# EAGLE design Ardy-Pro-Outlin-ev.3 (EAGLE 6.4)
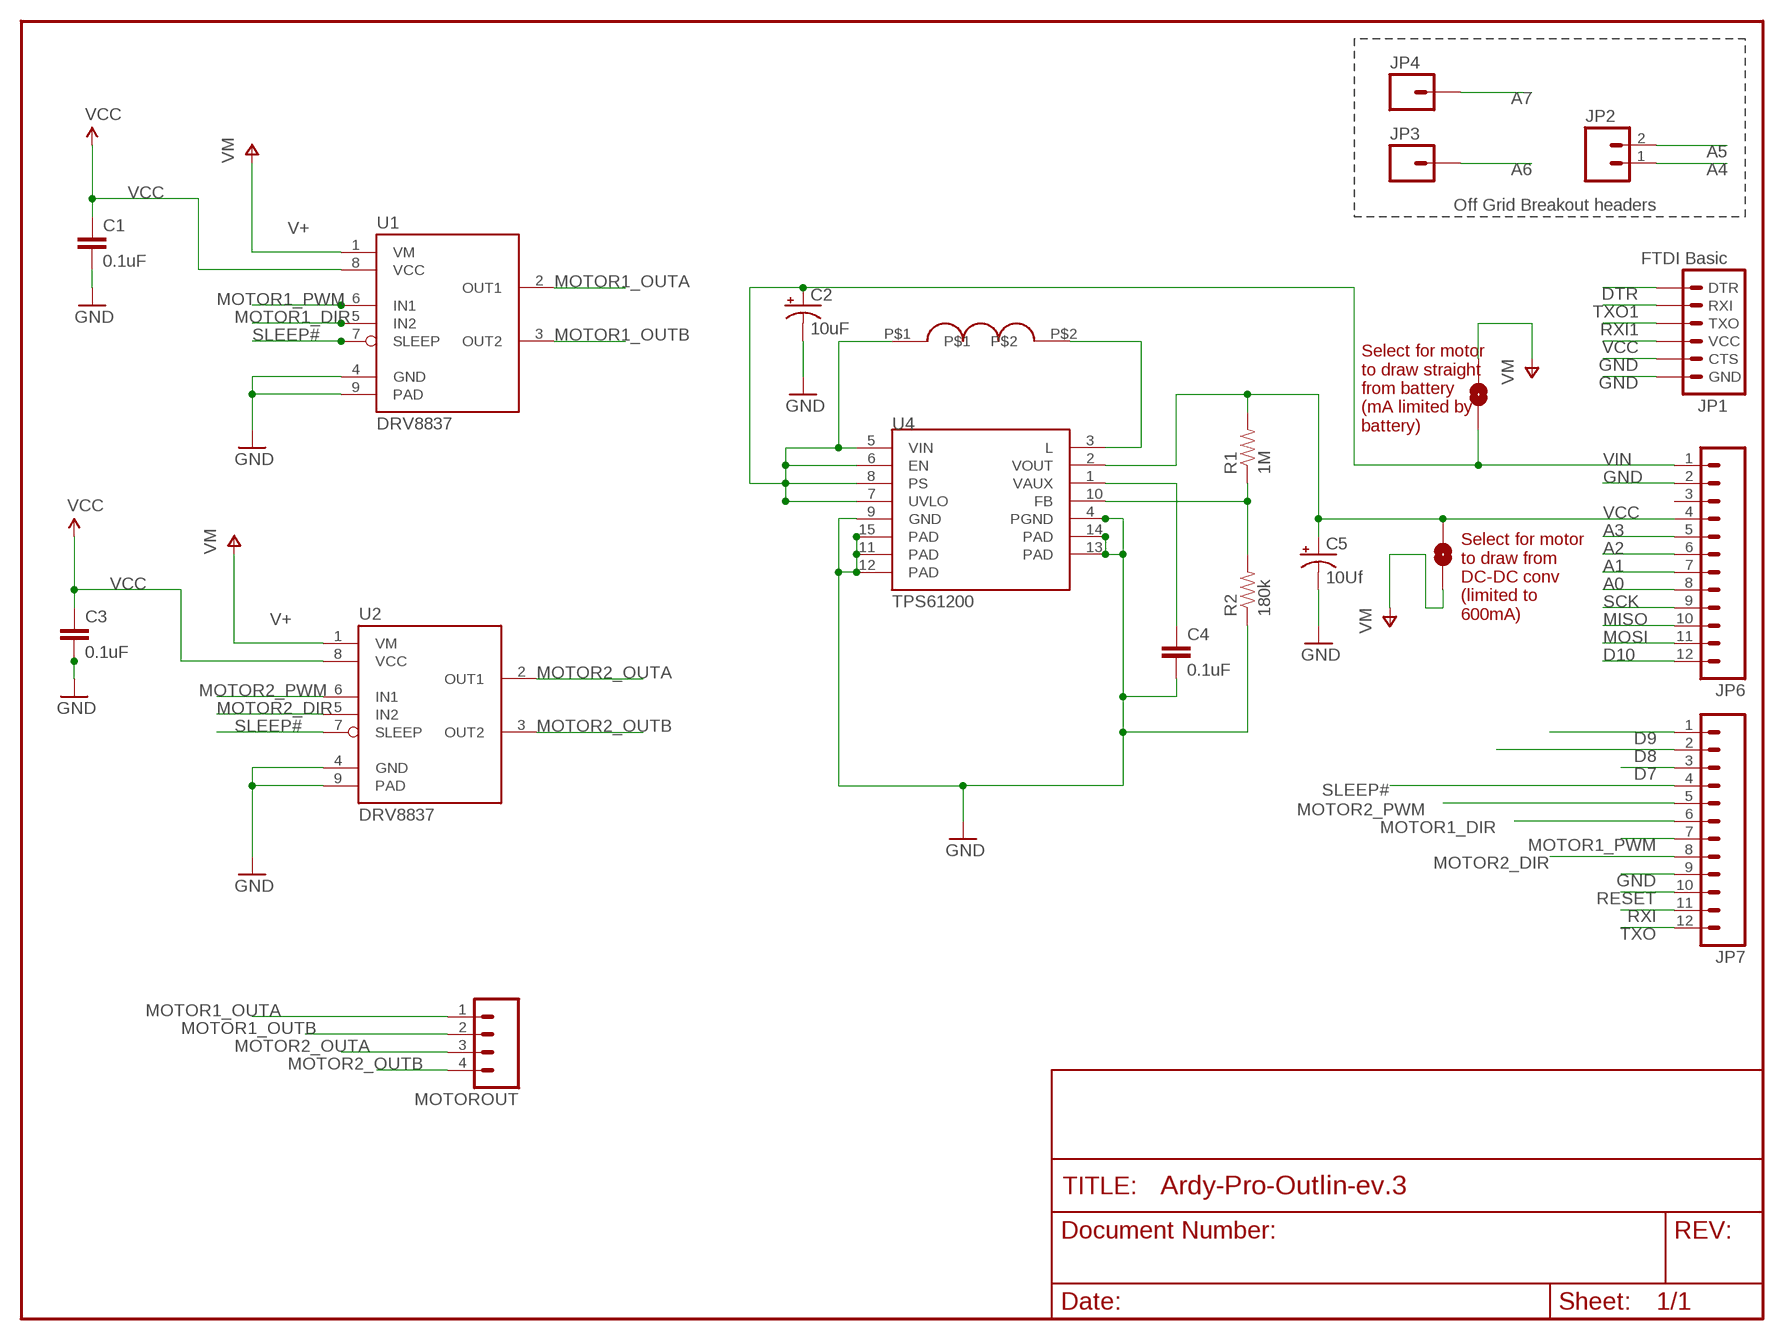
[diagram p0: schematic, sheet 1]

## Parts
2.2UH  2.2uh  2.2UHSMD  [PEBBLE_VLF4012A]
C1  0.1uF  CAP0805  [0805]
C2  10uF  CAP_POL1206  [EIA3216]
C3  0.1uF  CAP0805  [0805]
C4  0.1uF  CAP0805  [0805]
C5  10Uf  CAP_POL1206  [EIA3216]
JP1  FTDI Basic  ARDUINO_SERIAL_PROGRAMPTH  [1X06]
JP2  M02PTH  [1X02]
JP3  M01PTH  [1X01]
JP4  M01PTH  [1X01]
JP6  M12PTH  [1X12]
JP7  M12PTH  [1X12]
MOTOROUT  M04PTH  [1X04]
R1  1M  RESISTOR0805-RES  [0805]
R2  180k  RESISTOR0805-RES  [0805]
SJ1  SOLDERJUMPERNO  [SJ_2S-NO]
SJ2  SOLDERJUMPERNO  [SJ_2S-NO]
U1  DRV8837  AS-ITM-00042  [WSON-8]
U2  DRV8837  AS-ITM-00042  [WSON-8]
U4  TPS61200  [QFN-10_PAD]

## Nets
A0: JP6.8
A1: JP6.7
A2: JP6.6
A3: JP6.5
A4: JP2.1
A5: JP2.2
A6: JP3.1
A7: JP4.1
D7: JP7.3
D8: JP7.2
D9: JP7.1
D10: JP6.12
DTR: JP1.1(DTR)
GND [vcc]: C1.2 C2.C(-) C3.2 C4.2 C5.C(-) JP1.5(CTS) JP1.6(GND) JP6.2 JP7.9 R2.1 U1.4(GND) U1.9(PAD) U2.4(GND) U2.9(PAD) U4.4(PGND) U4.9(GND) U4.11(PAD) U4.12(PAD) U4.13(PAD) U4.14(PAD) U4.15(PAD)
MISO: JP6.10
MOSI: JP6.11
MOTOR1_DIR: JP7.6 U1.5(IN2)
MOTOR1_OUTA: MOTOROUT.1 U1.2(OUT1)
MOTOR1_OUTB: MOTOROUT.2 U1.3(OUT2)
MOTOR1_PWM: JP7.7 U1.6(IN1)
MOTOR2_DIR: JP7.8 U2.5(IN2)
MOTOR2_OUTA: MOTOROUT.3 U2.2(OUT1)
MOTOR2_OUTB: MOTOROUT.4 U2.3(OUT2)
MOTOR2_PWM: JP7.5 U2.6(IN1)
N$1: 2.2UH.P$2 U4.3(L)
N$2: C4.1 U4.1(VAUX)
N$3: R1.1 R2.2 U4.10(FB)
RESET: JP7.10
RXI: JP7.11
RXI1: JP1.3(TXO)
SCK: JP6.9
SLEEP#: JP7.4 U1.7(SLEEP) U2.7(SLEEP)
TXO: JP7.12
TXO1: JP1.2(RXI)
V+ [vcc]: SJ1.1 SJ2.2 U1.1(VM) U2.1(VM) ; supply symbol labelled VM
VCC: C1.1 C3.1 C5.A(+) JP1.4(VCC) JP6.4 R1.2 SJ1.2 U1.8(VCC) U2.8(VCC) U4.2(VOUT)
VIN: 2.2UH.P$1 C2.A(+) JP6.1 SJ2.1 U4.5(VIN) U4.6(EN) U4.7(UVLO) U4.8(PS)
Unconnected: JP6.3

## Notes on the sheet
- Off Grid Breakout headers
- Select for motor
  to draw straight
  from battery
  (mA limited by
  battery)
- Select for motor
  to draw from
  DC-DC conv
  (limited to
  600mA)

## Library data of the parts
2.2UH = Swarm Mini_Fet_Shield-v.01:2.2UHSMD
C1 C3 C4 = SparkFun:CAP: Capacitor Standard 0603 ceramic capacitor, and 0.1" leaded capacitor.
C2 C5 = SparkFun:CAP_POL: Capacitor Polarized These are standard SMD and PTH capacitors. Normally 10uF, 47uF, and 100uF in electrolytic and tantalum varieties. Always verify the external diameter of the through hole cap, it varies with capacity, voltage, and manufacturer. The EIA devices should be standard.
JP1 = SparkFun:ARDUINO_SERIAL_PROGRAM
JP2 = SparkFun:M02: Header 2 Standard 2-pin 0.1" header. Use with straight break away headers (SKU : PRT-00116), right angle break away headers (PRT-00553), swiss pins (PRT-00743), machine pins (PRT-00117), and female headers (PRT-00115). Molex polarized connector foot print use with SKU : PRT-08233 with associated crimp pins and housings.
JP3 JP4 = SparkFun:M01: Header 1 Standard 1-pin 0.1" header. Use with straight break away headers (SKU : PRT-00116), right angle break away headers (PRT-00553), swiss pins (PRT-00743), machine pins (PRT-00117), and female headers (PRT-00115).
JP6 JP7 = SparkFun:M12: Header 12 Standard 12-pin 0.1" header. Use with straight break away headers (SKU : PRT-00116), right angle break away headers (PRT-00553), swiss pins (PRT-00743), machine pins (PRT-00117), and female headers (PRT-00115).
MOTOROUT = SparkFun:M04: Header 4 Standard 4-pin 0.1" header. Use with straight break away headers (SKU : PRT-00116), right angle break away headers (PRT-00553), swiss pins (PRT-00743), machine pins (PRT-00117), and female headers (PRT-00115). Molex polarized connector foot print use with SKU : PRT-08231 with associated crimp pins and housings. 1MM SMD Version SKU: PRT-10208
R1 R2 = SparkFun:RESISTOR: Resistor Basic schematic elements and footprints for 0603, 1206, and PTH resistors.
SJ1 SJ2 = SparkFun:SOLDERJUMPER: Solder Jumper Standard SMD solder jumper. Used to automate production. Two varients : Normally Open and Normally Closed are the same, but have different paste layers. NC will have a large amount of paste and should jumper during reflow.
U1 U2 = tinycircuits:AS-ITM-00042: IC PWM MOTR DVR H-BRDG 8WSON; PARTNO: AS-ITM-00042
U4 = SparkFun:TPS61200: DC to DC Booster

## Net classes
0 default: width 0.203 mm
1 vcc: width 0.254 mm

## Board
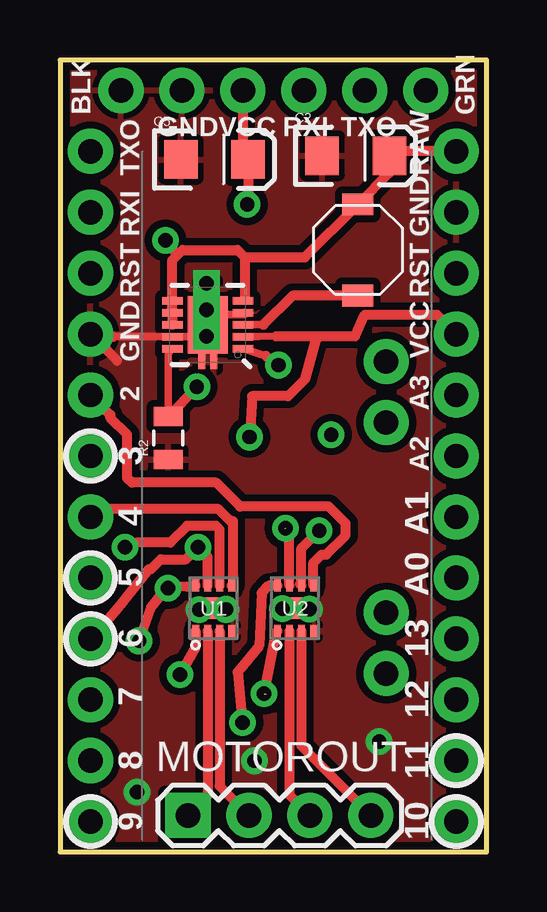
[diagram p1: board, top side]
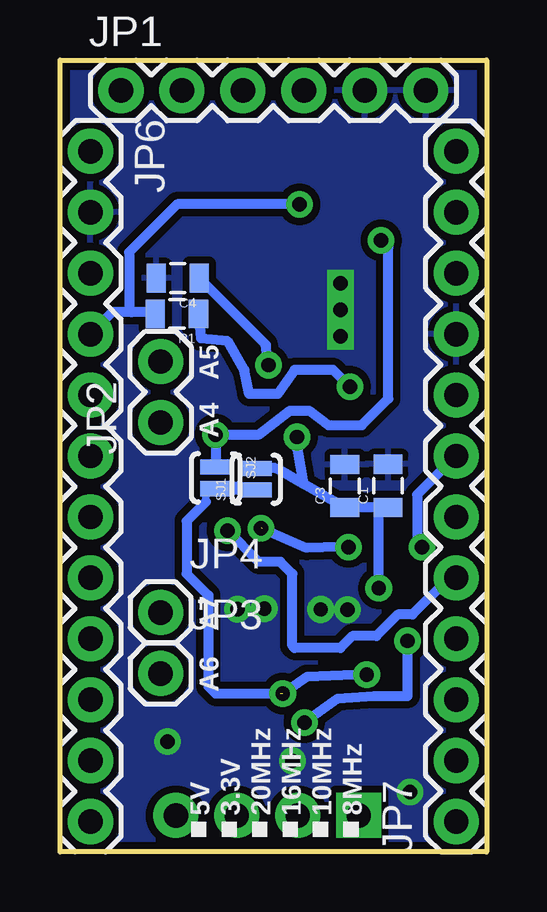
[diagram p2: board, bottom side, seen from below]

Size 17.78 x 33.02 mm. Coordinates in mm from the lower left corner, seen from the top.
Outline: 0,33.02 0,0 17.78,0 17.78,33.02 0,33.02
Copper layers (1*16): Top 0.035mm / dielectric 1.5mm / Bottom 0.035mm
Design rules "default": minimum track width 8mil, minimum drill 20mil, track to track 8mil, track to pad 8mil, pad to pad 8mil, via to via 8mil, smd to smd 8mil, copper to edge 8mil, drill to drill 8mil, minimum pad ring 12mil, minimum via ring 10mil, stop-mask expansion 4mil, vias tented up to drill 20mil, thermal gap 10mil

### Footprints (pad centres in the part's own frame; a part is rotated, then mirrored left to right if it is on the bottom)
PEBBLE_VLF4012A = smd 0.9 x 1.3: P$1 -1.9,0; P$2 1.9,0
0805 = smd 0.8 x 1.2: 1 -0.9,0; 2 0.9,0
EIA3216 = smd 1.4 x 1.6: A 1.4,0; C -1.4,0
1X06 = drill 1.016 pad 1.88: 1 0,0; 2 2.54,0; 3 5.08,0; 4 7.62,0; 5 10.16,0; 6 12.7,0
1X02 = drill 1.016 pad 1.88: 1 0,0; 2 2.54,0
1X01 = drill 1.016 pad 1.88: 1 0,0
1X12 = drill 1.016 pad 1.88: 1 0,0; 2 2.54,0; 3 5.08,0; 4 7.62,0; 5 10.16,0; 6 12.7,0; 7 15.24,0; 8 17.78,0; 9 20.32,0; 10 22.86,0; 11 25.4,0; 12 27.94,0
1X04 = drill 1.016 pad 1.88 square: 1 0,0 | drill 1.016 pad 1.88: 2 2.54,0; 3 5.08,0; 4 7.62,0
SJ_2S-NO = smd 0.635 x 1.27: 1 -0.45,0; 2 0.45,0
WSON-8 = smd 0.28 x 0.5: 1 -0.75,-0.95; 2 -0.25,-0.95; 3 0.25,-0.95; 4 0.75,-0.95; 5 0.75,0.95; 6 0.25,0.95; 7 -0.25,0.95; 8 -0.75,0.95 | smd 1.6 x 0.9: 9 0,0
QFN-10_PAD = smd 0.297 x 0.85: 1 -1,-1.475; 2 -0.5,-1.475; 3 0,-1.475; 4 0.5,-1.475; 5 1,-1.475; 6 1,1.475; 7 0.5,1.475; 8 0,1.475; 9 -0.5,1.475; 10 -1,1.475 | smd 0.7 x 0.28: 11 -1.5,0.25; 12 -1.5,-0.25; 13 1.5,0.25; 14 1.5,-0.25 | smd 2.4 x 1.65: 15 0,0

### Placement (x,y rotation side)
2.2UH  12.4,25.1 270 top
C1  4.11,15.27 90 bottom
C2  12.32,29.02 0 top
C3  5.91,15.26 90 bottom
C4  12.87,23.92 180 bottom
C5  6.44,28.87 0 top
JP1  15.24,31.75 0 bottom
JP2  13.59,17.91 90 bottom
JP3  13.59,7.44 0 bottom
JP4  13.59,9.98 0 bottom
JP6  16.51,29.21 270 bottom
JP7  1.27,1.27 90 bottom
MOTOROUT  5.33,1.52 0 top
R1  12.91,22.44 180 bottom
R2  4.5,17.26 90 top
SJ1  9.6,15.54 90 bottom
SJ2  11.3,15.6 270 bottom
U1  6.41,10.16 0 top
U2  9.81,10.16 0 top
U4  6.16,21.98 90 top

### Tracks (layer width: path | path; a pad name or v marks a point on that pad's centre or on a via)
GND  (via drill 0.6)
  Top 0.305: 2.2,21.48 U4.9 5.89,21.48 5.91,21.5 | U4.4 7.68,22.48 7.7,22.5 7.7,22.4 6.58,22.4 | U4.11 5.91,21.5 | 5.91,21.5 5.91,21.73 U4.15
  Top 0.406: 2.2,21.48 1.38,21.48 JP7.9 2.38,20.48 | U4.13 6.16,23.23 U4.15 6.58,22.4
  other vias: 5.8,10.1 6.92,10.11 8.1,3.8 3.2,2.5 9.27,10.14 10.39,10.12 13.3,4.6 6.1,22.6 6.1,21.5 6.1,23.7
  pour Top (isolate 0.305): 0,33.02 17.78,33.02 17.78,0 0,0
  pour Bottom (isolate 0.305): 0,33.02 17.78,33.02 17.78,0 0,0
MOTOR1_DIR
  Top 0.406: U1.5 7.2,11.15 7.2,13.8 7.1,13.8 6.6,14.3 1.6,14.3 JP7.6
MOTOR1_OUTA
  Top 0.406: U1.2 6.16,2.35 MOTOROUT.1
MOTOR1_OUTB
  Top 0.406: U1.3 6.66,2.74 MOTOROUT.2
MOTOR1_PWM  (via drill 0.6)
  Top 0.406: U1.6 6.65,13.45 6.5,13.6 5.3,13.6 4.6,12.9 3.2,12.9 v2.7,12.7
  Bottom 0.406: JP7.7 1.29,16.51 2.9,14.9 2.9,13 v2.7,12.7
MOTOR2_DIR
  Top 0.406: U2.5 10.56,12.06 10.9,12.4 11.1,12.4 11.9,13.2 11.9,13.7 11.2,14.4 7.5,14.4 6.5,15.4 3,15.4 2.8,15.6 2.8,17.4 2.1,18.1 2.1,18.22 JP7.8
MOTOR2_OUTA
  Top 0.406: U2.2 9.56,2.38 MOTOROUT.3
MOTOR2_OUTB
  Top 0.406: U2.3 10.06,4.42 MOTOROUT.4
MOTOR2_PWM  (via drill 0.6)
  Top 0.406: 10,11.17 U2.6 10.06,12.66 v10.8,13.4
  Bottom 0.406: JP7.5 1.57,11.43 3.1,9.9 3.7,9.9 4.6,9 5.6,9 6.1,8.5 8,8.5 8.1,8.6 8.1,11.6 8.6,12.1 9.5,12.1 v10.8,13.4
N$1
  Top 0.305: U4.3 8.48,21.98
  Top 0.406: 2.2UH.P$2 9.7,23.2 8.48,21.98
N$2  (via drill 0.6)
  Top 0.305: U4.1 8.58,20.68
  Top 0.406: 8.58,20.68 v9.1,20.3
  Bottom 0.406: v9.1,20.3 9.2,21.15 C4.1
N$3  (via drill 0.6)
  Top 0.305: R2.2 4.5,20.8 U4.10
  Top 0.406: v5.7,19.4 5.7,19.36 R2.2
  Bottom 0.406: R1.1 11.91,21.41 10.8,21.3 10.1,20.1 9.9,19.1 8.7,19.1 8,20.1 6.4,20.1 v5.7,19.4
SLEEP#  (via drill 0.6)  (1 unrouted)
  Top 0.406: U1.7 6.16,12.32 v5.76,12.71 5.24,12.2 4.2,12.2 3.8,11.8 3.7,11.8 2.5,10.3 1.58,9.2 JP7.4 | U2.7 9.56,13.34 v9.4,13.5
  Bottom 0.406: 9.36,13.48 7.5,12.68 6.13,12.71 v5.76,12.71
V+  (via drill 0.6)  (1 unrouted)
  Top 0.406: U1.1 5.66,8.56 v5,7.4 | v8.5,6.6 9,9.15 U2.1
  Bottom 0.305: 11.61,15.09 11.7,15 11.7,14.6
  Bottom 0.406: v5,7.4 7.5,7.3 v8.5,6.6 | 8.6,6.6 11.3,6.6 11.6,6.9 11.6,10.7 12.5,11.6 12.5,13.8 11.7,14.6 | 11.6,15.2 SJ2.2 10.34,15.25 SJ1.1 11.61,15.09
VCC  (via drill 0.6)
  Top 0.305: U4.2 8.28,21.48 9,21.5
  Top 0.406: U1.8 5.3,11.06 4.7,11.1 4.6,11.1 v4.5,11 4.2,10.7 3.8,10.2 v3.3,8.8 | U2.8 8.71,11.11 8.4,10.8 8.3,8.6 7.4,7.5 v7.6,5.4 | 9,21.5 10.7,21.5 | 10.7,21.5 10.2,19.7 9.5,19 8,19 v7.9,17.3 | 10.7,21.5 12.3,21.5 12.7,22.4 15.7,22.4 JP6.4 | JP1.4 7.62,29.09 C5.A 7.84,27.04 v7.8,27
  Bottom 0.406: v7.6,5.4 6.2,6.4 4.7,6.5 3.3,6.5 v3.3,8.8 | v4.5,11 4.5,14.18 C1.1 4.8,14.37 C3.1 7.66,15.36 7.65,15.35 | R1.2 14.05,22.5 14.8,22.5 | 14.8,22.5 15.6,22.5 JP6.4 | 7.65,15.35 8.8,16 9.69,16 SJ1.2 | v7.9,17.3 7.9,16.8 7.65,15.35 | v7.8,27 12.9,27 14.9,25 14.9,22.6 14.8,22.5
VIN  (via drill 0.6)
  Top 0.305: 7.7,23.05 U4.5
  Top 0.406: U4.8 U4.7 U4.6 4.68,24.68 4.9,24.9 | 4.9,24.9 5.1,25.1 7.4,25.1 7.7,24.8 | 7.7,24.8 7.7,23.05 | 7.7,24.8 10.21,24.8 2.2UH.P$1 13.72,28.32 C2.A 13.91,29.21 JP6.1 | v4.4,25.5 4.4,25.4 4.9,24.9
  Bottom 0.406: SJ2.1 v11.3,17.4 9.5,17.4 8.2,18.4 7.4,18.4 6.6,17.8 5.2,17.8 4.1,18.9 4.1,25.2 v4.4,25.5

### Text on the board
tPlace: BLK | GRN | GND | VCC | RXI | TXO | TXO | RAW | RXI | GND | RST | RST | VCC | GND | 2 | A3 | 3 | A2 | 4 | A1 | 5 | A0 | 6 | 13 | 7 | 12 | 8 | 11 | 9 | 10
bPlace: A5 | A4 | A7 | A6 | 8MHz | 10MHz | 16MHz | 20MHz | 3.3V | 5V